# Altium project back breakout.PrjPcb
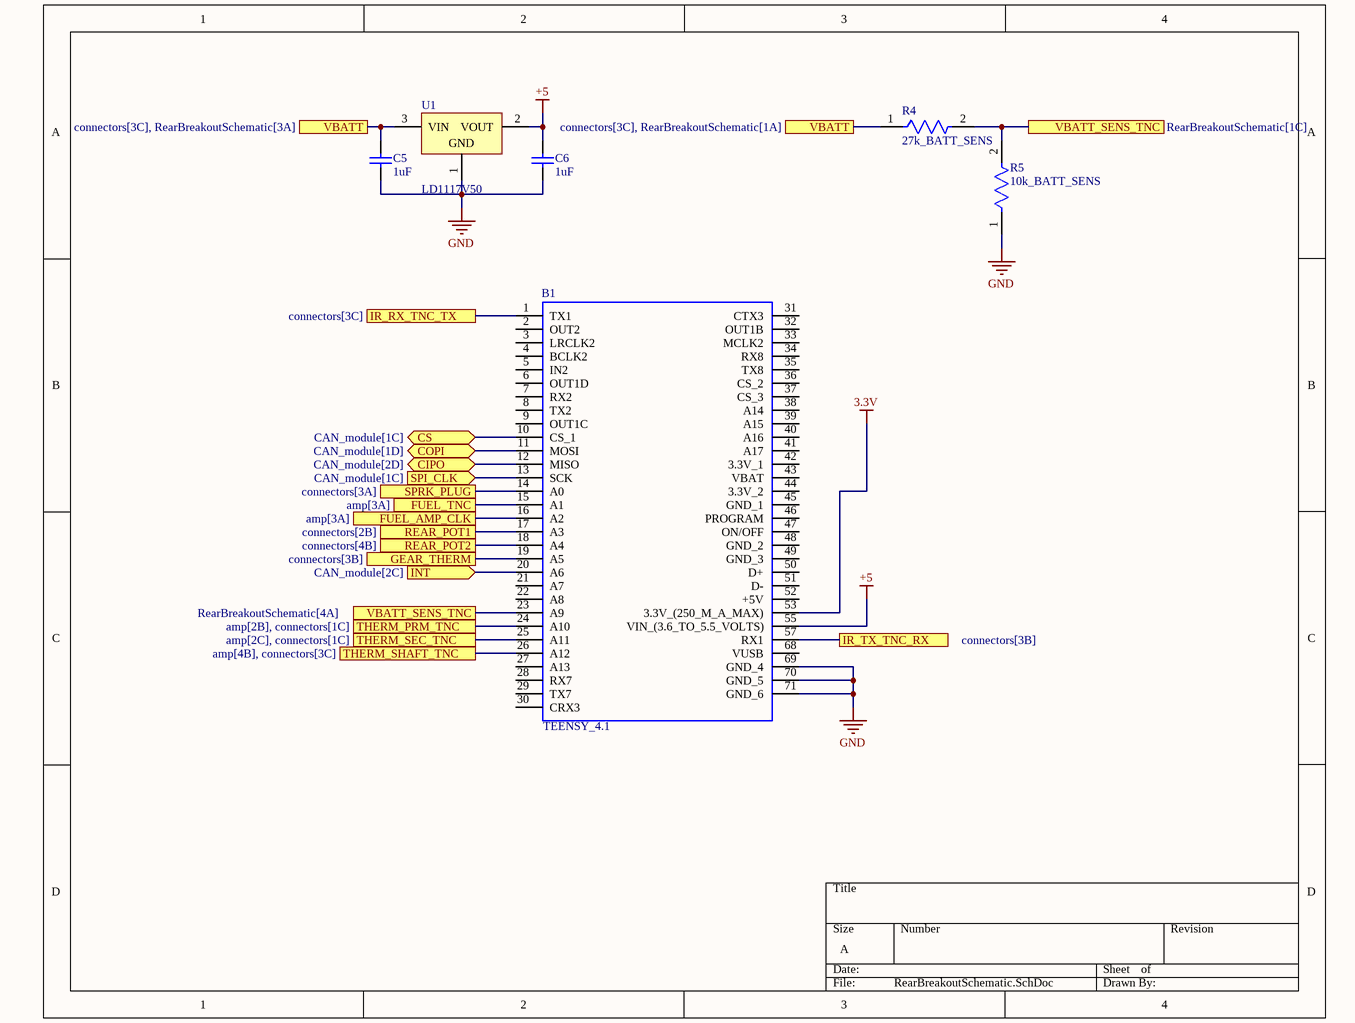
[diagram p0: RearBreakoutSchematic.SchDoc]
4 sheets, 34 parts. Net scope: flat (ports and power ports of the same name join across sheets).
Board file: backBreakoutPCB.PcbDoc
Sheets:
  RearBreakoutSchematic.SchDoc
  CAN_module.SchDoc
  connectors.SchDoc
  amp.SchDoc

## Sheet RearBreakoutSchematic.SchDoc
size A; SheetNumber: 1; SheetTotal: 4

### Parts
B1  TEENSY_4.1  [TEENSY41]
C5  1uF  [CAPC2013X145X50LL20T25]
C6  1uF  [CAPC2013X145X50LL20T25]
R4  27k_BATT_SENS  [FP-CRCW0805-e3-IPC_C]
R5  10k_BATT_SENS  [FP-CRCW0805-e3-IPC_C]
U1  LD1117V50  [TO220]

### Ports
CIPO (bidir, see CAN_module[2D]), COPI (bidir, see CAN_module[1D]), CS (bidir, see CAN_module[1C]), FUEL_AMP_CLK (see amp[3A]), FUEL_TNC (see amp[3A]), GEAR_THERM (see connectors[3B]), INT (in, see CAN_module[2C]), IR_RX_TNC_TX (see connectors[3C]), IR_TX_TNC_RX (see connectors[3B]), REAR_POT1 (see connectors[2B]), REAR_POT2 (see connectors[4B]), SPI_CLK (in, see CAN_module[1C]), SPRK_PLUG (see connectors[3A]), THERM_PRM_TNC (see amp[2B], connectors[1C]), THERM_SEC_TNC (see amp[2C], connectors[1C]), THERM_SHAFT_TNC (see amp[4B], connectors[3C]), VBATT (see connectors[3C], RearBreakoutSchematic[1A]), VBATT (see connectors[3C], RearBreakoutSchematic[3A]), VBATT_SENS_TNC (see RearBreakoutSchematic[1C]), VBATT_SENS_TNC (see RearBreakoutSchematic[4A])

### Nets
3.3V: B1.53(3.3V_(250_M_A_MAX))
+5: B1.55(VIN_(3.6_TO_5.5_VOLTS)) C6.2 U1.2(VOUT)
GND: B1.69(GND_4) B1.70(GND_5) B1.71(GND_6) C5.1 C6.1 R5.1 U1.1(GND)
REAR_POT1: B1.17(A3) ; port REAR_POT1
REAR_POT2: B1.18(A4) ; port REAR_POT2
NetB1_1: B1.1(TX1) ; port IR_RX_TNC_TX
NetB1_10: B1.10(CS_1) ; port CS
NetB1_11: B1.11(MOSI) ; port COPI
NetB1_12: B1.12(MISO) ; port CIPO
NetB1_13: B1.13(SCK) ; port SPI_CLK
NetB1_14: B1.14(A0) ; port SPRK_PLUG
NetB1_15: B1.15(A1) ; port FUEL_TNC
NetB1_16: B1.16(A2) ; port FUEL_AMP_CLK
NetB1_19: B1.19(A5) ; port GEAR_THERM
NetB1_20: B1.20(A6) ; port INT
NetB1_23: B1.23(A9) R4.2 R5.2 ; port VBATT_SENS_TNC
NetB1_24: B1.24(A10) ; port THERM_PRM_TNC
NetB1_25: B1.25(A11) ; port THERM_SEC_TNC
NetB1_26: B1.26(A12) ; port THERM_SHAFT_TNC
NetB1_57: B1.57(RX1) ; port IR_TX_TNC_RX
NetC5_2: C5.2 R4.1 U1.3(VIN) ; port VBATT

Not connected (* = marked no-connect by the designer): B1 2(OUT2) 3(LRCLK2) 4(BCLK2) 5(IN2) 6(OUT1D) 7(RX2) 8(TX2) 9(OUT1C) 21(A7) 22(A8) 27(A13) 28(RX7) 29(TX7) 30(CRX3) 31(CTX3) 32(OUT1B) 33(MCLK2) 34(RX8) 35(TX8) 36(CS_2) 37(CS_3) 38(A14) 39(A15) 40(A16) 41(A17) 42(3.3V_1) 43(VBAT) 44(3.3V_2) 45(GND_1) 46(PROGRAM) 47(ON/OFF) 48(GND_2) 49(GND_3) 50(D+) 51(D-) 52(+5V) 68(VUSB)

### Library data of the parts
B1 = TEENSY_4.1: Teensy 4.1 Development Board; Manufacturer_Name: PJRC; Manufacturer_Part_Number: TEENSY 4.1; Mouser Part Number: *; Mouser Price/Stock: *; Arrow Part Number: *; Arrow Price/Stock: *; Mouser Testing Part Number: *; Mouser Testing Price/Stock: *; Datasheet Link: https://www.pjrc.com/store/teensy41.html
C5 C6 = CMP-1036-04746-2: C0805C105K4PACTU; Manufacturer: Kemet; Part Number: C0805C105K4PACTU
R4 R5 = CMP-02407-009256-1: RES Thick Film, 4.02Ω, 1%, 0.125W, 200ppm/°C, 0805; Resistance: 4.02R; Power Rating: 125mW; Voltage Rating: 150V; Features: Automotive AEC-Q200; Weight: 0.000194oz; Height: 0.02inch; Case Code (Metric): 2012; Composition: Thick Film; Temperature Coefficient: 200ppm/°C; Case/Package: 0805; Min Operating Temperature: -55°C; Width: 0.049inch; Contact Plating: Tin; Packaging: Tape and Reel; Tolerance: 1%; Length: 0.079inch; Lead Free: Lead Free; Case Code (Imperial): 0805; Package Quantity: 5000; Radiation Hardening: No; Max Operating Temperature: 155°C; Number of Terminations: 2; Max Power Dissipation: 125mW; Voltage Rating (DC): 150V
U1 = CMP-0244-00472-1: Fixed Low Drop Positive Voltage Regulator, 5V, 3-Pin TO-220; ComponentLink1URL: http://www.st.com; ComponentLink1Description: Manufacturer URL; DatasheetVersion: 1/11/2011; PackageDescription: TO, Thru-Hole, Vertical, Heatsink Mounted; 3 In-Line Leads; Pitch 2.54 mm; ComponentLink2Description: Datasheet; ComponentLink3URL: http://www.st.com/internet/com/TECHNICAL_RESOURCES/TECHNICAL_LITERATURE/PACKAGE_INFORMATION/CD00004649.pdf; PackageVersion: ver3.0; PackageReference: TO220; ComponentLink2URL: http://www.st.com/internet/com/TECHNICAL_RESOURCES/TECHNICAL_LITERATURE/DATASHEET/CD00000544.pdf; ComponentLink3Description: Package Specification

## Sheet CAN_module.SchDoc
size A; SheetNumber: 2; SheetTotal: 4
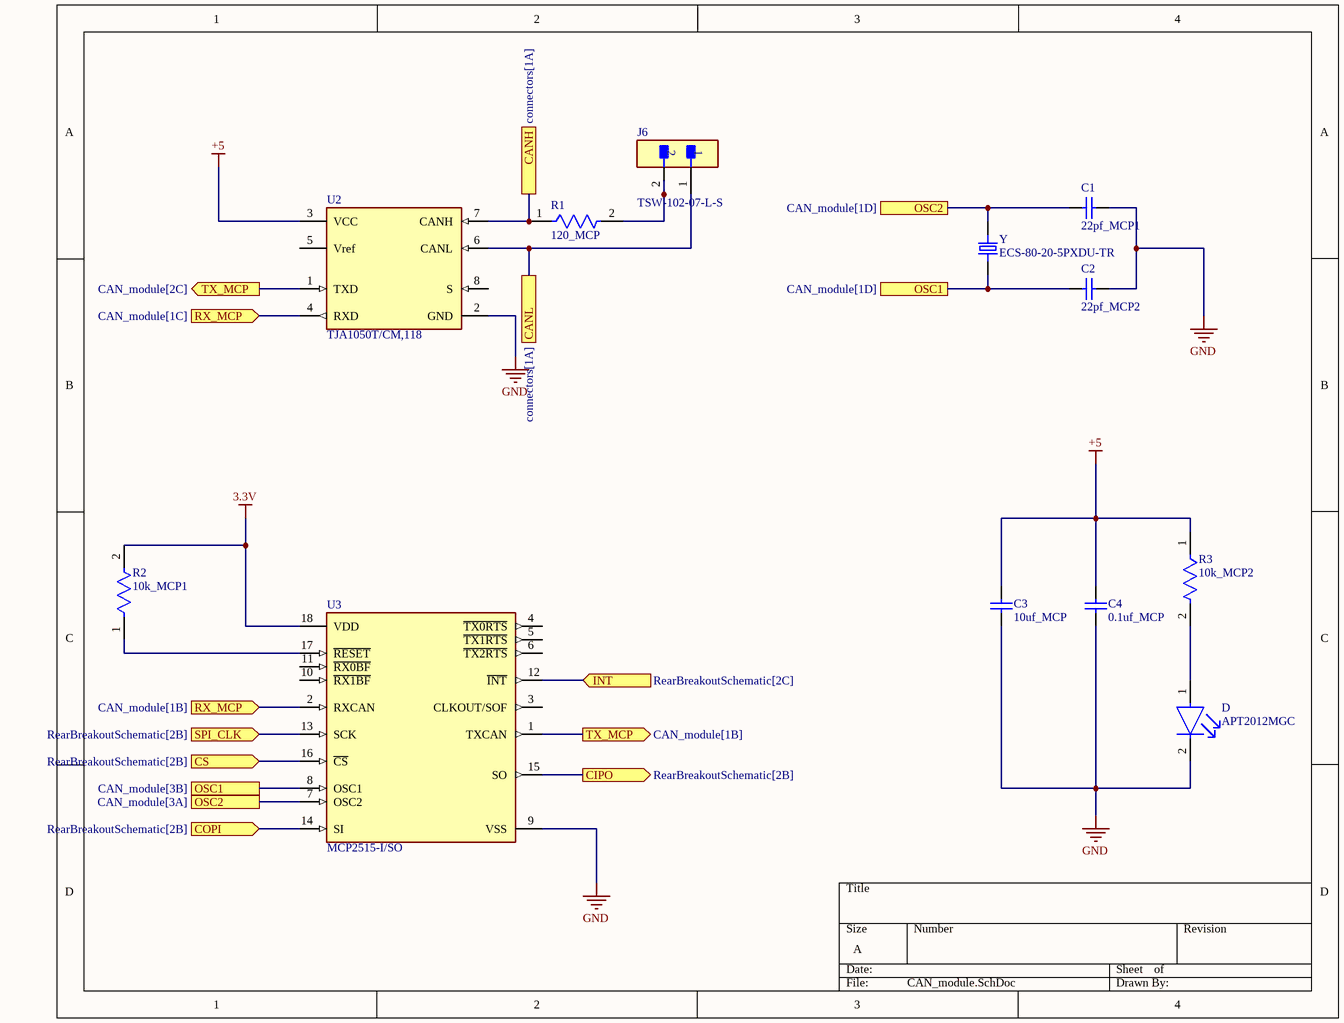
[diagram p1: CAN_module.SchDoc]

### Parts
C1  22pf_MCP1  [CAPC2013X145X50NL20T20]
C2  22pf_MCP2  [CAPC2013X145X50NL20T20]
C3  10uf_MCP  [CAPC2013X145X50NL20T20]
C4  0.1uf_MCP  [CAPC2013X145X50NL20T20]
D  APT2012MGC  [FP-APT2012MGC-MFG]
J6  TSW-102-07-L-S  [FP-TSW-102-07-L-S-MFG]
R1  120_MCP  [FP-CRCW0805-e3-IPC_C]
R2  10k_MCP1  [FP-CRCW0805-e3-IPC_C]
R3  10k_MCP2  [FP-CRCW0805-e3-IPC_C]
U2  TJA1050T/CM,118  [FP-SOT96-1-IPC_A]
U3  MCP2515-I/SO  [FP-C04-051-MFG]
Y  ECS-80-20-5PXDU-TR  [XTAL_ECS-80-20-5PXDU-TR]

### Ports
CANH (see connectors[1A]), CANL (see connectors[1A]), CIPO (out, see RearBreakoutSchematic[2B]), COPI (in, see RearBreakoutSchematic[2B]), CS (in, see RearBreakoutSchematic[2B]), INT (in, see RearBreakoutSchematic[2C]), OSC1 (see CAN_module[1D]), OSC1 (see CAN_module[3B]), OSC2 (see CAN_module[1D]), OSC2 (see CAN_module[3A]), RX_MCP (in, see CAN_module[1B]), RX_MCP (in, see CAN_module[1C]), SPI_CLK (in, see RearBreakoutSchematic[2B]), TX_MCP (out, see CAN_module[1B]), TX_MCP (out, see CAN_module[2C])

### Nets
3.3V: R2.2 U3.18(VDD)
+5: C3.2 C4.2 R3.1 U2.3(VCC)
GND: C1.2 C2.2 C3.1 C4.1 D.2(C) U2.2(GND) U3.9(VSS)
NetB1_10: U3.16(~{CS}) ; port CS
NetB1_11: U3.14(SI) ; port COPI
NetB1_12: U3.15(SO) ; port CIPO
NetB1_13: U3.13(SCK) ; port SPI_CLK
NetB1_20: U3.12(~{INT}) ; port INT
NetC1_1: C1.1 U3.7(OSC2) Y.2 ; port OSC2
NetC2_1: C2.1 U3.8(OSC1) Y.1 ; port OSC1
NetD_1: D.1(A) R3.2
NetJ1_3: J6.1 U2.6(CANL) ; port CANL
NetJ1_4: R1.1 U2.7(CANH) ; port CANH
NetJ6_2: J6.2 R1.2
NetR2_1: R2.1 U3.17(~{RESET})
NetU2_1: U2.1(TXD) U3.1(TXCAN) ; port TX_MCP
NetU2_4: U2.4(RXD) U3.2(RXCAN) ; port RX_MCP

Not connected (* = marked no-connect by the designer): U2 5(Vref) 8(S); U3 3(CLKOUT/SOF) 4(~{TX0RTS}) 5(~{TX1RTS}) 6(~{TX2RTS}) 10(~{RX1BF}) 11(~{RX0BF})

### Library data of the parts
C1-C4 = CMP-1036-01227-2: Manufacturer: Vitramon; Part Number: VJ0805A220GXXCW1BC
D = CMP-44529-000017-1: LED GREEN CLEAR CHIP SMD; Power Rating: 75mW; Lens Color: Colorless; Luminous Intensity: 70mcd; Forward Current: 20mA; Dominant Wavelength: 570nm; Viewing Angle: 120°; Forward Voltage: 2.1V; Package Quantity: 2000; Color: Green; Length: 2mm; Lead Free: Lead Free; Min Operating Temperature: -40°C; Illumination Color: Green; Case/Package: 0805; Width: 1.25mm; Test Current: 20mA; Max Operating Temperature: 85°C; Case Code (Imperial): 0805; Mount: Surface Mount; Lens Style: Clear; Height: 0.75mm; Case Code (Metric): 2012; Packaging: Tape and Reel; Lens Transparency: Clear
J6 = CMP-02766-001428-1: CONN HEADER VERT 2POS 2.54MM; Voltage Rating: 550V; Current Rating: 7.6A; Gender: Male; Number of Contacts: 2; Connector Type: Male Pin; Radiation Hardening: No; Orientation: Straight; Contact Plating: Gold; Max Operating Temperature: 125°C; Mount: Through Hole; Package Quantity: 1; Number of Rows: 1; Housing Material: Polyester; RoHS Compliant: Yes; Length: 5.08mm; Max Voltage Rating (AC): 550V; Pitch: 2.54mm; Packaging: Bulk; Depth: 2.54mm; Termination: Solder; Min Operating Temperature: -55°C; Housing Color: Black; Lead Free: Lead Free; Color: Black; Number of Positions: 2; Width: 2.54mm; Max Current Rating: 7.6A; REACH SVHC: No SVHC; Contact Material: Bronze; Contact Mating Length: 0.23inch; Series: TSW; Contact Type: Male Pin
R1-R3 = CMP-02407-009256-1: as R4 on sheet RearBreakoutSchematic; Features: Automotive AEC-Q200; Weight: 0.000194oz; Height: 0.02inch; Case Code (Metric): 2012; Composition: Thick Film; Temperature Coefficient: 200ppm/°C; Case/Package: 0805; Min Operating Temperature: -55°C; Width: 0.049inch; Contact Plating: Tin; Packaging: Tape and Reel; Tolerance: 1%; Length: 0.079inch; Lead Free: Lead Free; Case Code (Imperial): 0805; Package Quantity: 5000; Radiation Hardening: No; Max Operating Temperature: 155°C; Number of Terminations: 2; Max Power Dissipation: 125mW; Voltage Rating (DC): 150V
U2 = CMP-2000-04923-2: IC TRANSCEIVER HALF 1/1 8SO; Simplex/Duplex: Half Duplex; Max Supply Current: 10mA; Number of Receive Buffers: 1; Min Supply Voltage: 4.75V; Max Supply Voltage: 5.25V; Interface: CAN; Data Rate: 1Mbps; Receiver Hysteresis: 70mV; Number of Transmit Buffers: 1; Min Operating Temperature: -40°C; Case/Package: SO; REACH SVHC: No SVHC; Max Operating Temperature: 150°C; Number of Pins: 8; Lead Free: Lead Free; Number of Transceivers: 1; Packaging: Tape and Reel; Mount: Surface Mount; Radiation Hardening: No; Nominal Supply Current: 10mA; Package Quantity: 2500; Contact Plating: Gold
U3 = CMP-0186-00133-3: IC CAN CONTROLLER W/SPI 18SOIC; Manufacturer: Microchip; Min Supply Voltage: 2.7V; Max Supply Voltage: 5.5V; Standoff Height: 0.1mm; Nominal Supply Current: 10mA; Interface: SPI,CAN; Lead Free: Yes; Digikey Description: IC CAN CONTROLLER W/SPI 18SOIC; Category: IC; RoHS: TRUE; Manufacturer Part Number: MCP2515-I/SO; ComponentLink2URL: http://ww1.microchip.com/downloads/en/DeviceDoc/MCP2515-Stand-Alone-CAN-Controller-with-SPI-20001801J.pdf; Mouser Description: CAN Interface IC W/ SPI Interface; Device Class L2: Interface ICs; Package: C04-051; Automotive: No; Function: Controller; Octopart: https://octopart.com/mcp2515-i%2Fso-microchip-430187; Temperature: -40°C to +85°C; Ipc Land Pattern Name: SOIC127P1030X265-18; Ambient Temperature Range Low: -65°C; Height: 2.65mm; Device Class L1: Integrated Circuits (ICs); Ambient Temperature Range High: +125°C; Footprint Url: http://ww1.microchip.com/downloads/en/DeviceDoc/18L_SOIC_Wide_7.50_SO_C04-0051D.pdf; Temperature Range Low: -40°C; Device Class L3: Controllers; Temperature Range High: +85°C; ComponentLink2Description: Datasheet
Y = ECS-80-20-5PXDU-TR: 8MHz Â±30ppm Crystal 20pF 60 Ohms HC-49/US; MF: ECS Inc.; Package: HC49/US ECS International; Availability: Unavailable; Value: *; MP: ECS-80-20-5PXDU-TR; SnapEDA_Link: https://www.snapeda.com/parts/ECS-80-20-5PXDU-TR/ECS%20Inc./view-part/584052/?ref=snap; Price: None

## Sheet connectors.SchDoc
size A; SheetNumber: 3; SheetTotal: 4
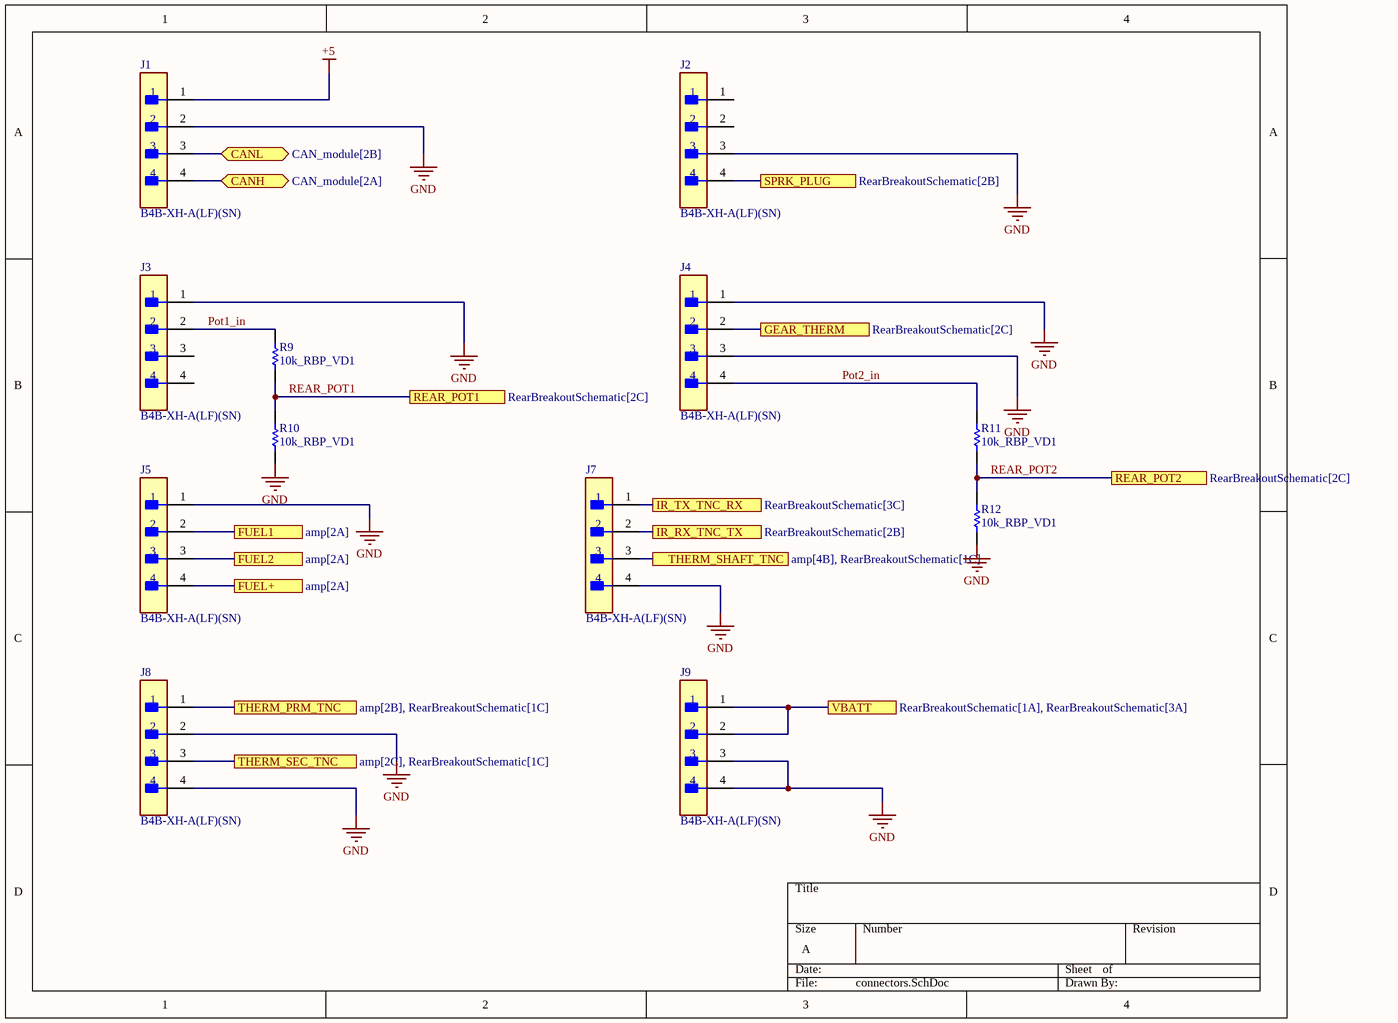
[diagram p2: connectors.SchDoc]

### Parts
J1  B4B-XH-A(LF)(SN)  [FP-B4B-XH-A_LF_SN-MFG]
J2  B4B-XH-A(LF)(SN)  [FP-B4B-XH-A_LF_SN-MFG]
J3  B4B-XH-A(LF)(SN)  [FP-B4B-XH-A_LF_SN-MFG]
J4  B4B-XH-A(LF)(SN)  [FP-B4B-XH-A_LF_SN-MFG]
J5  B4B-XH-A(LF)(SN)  [FP-B4B-XH-A_LF_SN-MFG]
J7  B4B-XH-A(LF)(SN)  [FP-B4B-XH-A_LF_SN-MFG]
J8  B4B-XH-A(LF)(SN)  [FP-B4B-XH-A_LF_SN-MFG]
J9  B4B-XH-A(LF)(SN)  [FP-B4B-XH-A_LF_SN-MFG]
R9  10k_RBP_VD1  [RESC2013X60X40LL20T25]
R10  10k_RBP_VD1  [RESC2013X60X40LL20T25]
R11  10k_RBP_VD1  [RESC2013X60X40LL20T25]
R12  10k_RBP_VD1  [RESC2013X60X40LL20T25]

### Ports
CANH (bidir, see CAN_module[2A]), CANL (bidir, see CAN_module[2B]), FUEL1 (see amp[2A]), FUEL2 (see amp[2A]), FUEL+ (see amp[2A]), GEAR_THERM (see RearBreakoutSchematic[2C]), IR_RX_TNC_TX (see RearBreakoutSchematic[2B]), IR_TX_TNC_RX (see RearBreakoutSchematic[3C]), REAR_POT1 (see RearBreakoutSchematic[2C]), REAR_POT2 (see RearBreakoutSchematic[2C]), SPRK_PLUG (see RearBreakoutSchematic[2B]), THERM_PRM_TNC (see amp[2B], RearBreakoutSchematic[1C]), THERM_SEC_TNC (see amp[2C], RearBreakoutSchematic[1C]), THERM_SHAFT_TNC (see amp[4B], RearBreakoutSchematic[1C]), VBATT (see RearBreakoutSchematic[1A], RearBreakoutSchematic[3A])

### Nets
+5: J1.1
GND: J1.2 J2.3 J3.1 J4.1 J4.3 J5.1 J7.4 J8.2 J8.4 J9.3 J9.4 R10.1 R12.1
Pot1_in: J3.2 R9.2
Pot2_in: J4.4 R11.2
REAR_POT1: R9.1 R10.2 ; port REAR_POT1
REAR_POT2: R11.1 R12.2 ; port REAR_POT2
NetB1_1: J7.2 ; port IR_RX_TNC_TX
NetB1_14: J2.4 ; port SPRK_PLUG
NetB1_19: J4.2 ; port GEAR_THERM
NetB1_24: J8.1 ; port THERM_PRM_TNC
NetB1_25: J8.3 ; port THERM_SEC_TNC
NetB1_26: J7.3 ; port THERM_SHAFT_TNC
NetB1_57: J7.1 ; port IR_TX_TNC_RX
NetC5_2: J9.1 J9.2 ; port VBATT
NetJ1_3: J1.3 ; port CANL
NetJ1_4: J1.4 ; port CANH
NetJ5_2: J5.2 ; port FUEL1
NetJ5_3: J5.3 ; port FUEL2
NetJ5_4: J5.4 ; port FUEL+

Not connected (* = marked no-connect by the designer): J2 1 2; J3 3 4

### Library data of the parts
J1-J5 J7-J9 = CMP-17439-000250-1: CONN HEADER VERT 4POS 2.5MM; Number of Contacts: 4; Contact Resistance: 20mR; Voltage Rating: 250V; Max Current Rating: 3A; Gender: Male; Wire/Cable Gauge: 22AWG; Mated Stacking Heights: 9.8mm; Insulation Resistance: 1GR; Orientation: Straight; Contact Type: Male Pin; Contact Finish - Mating: TIN; Series: XH; Max Voltage Rating (AC): 250V; Lead Pitch: 2.5mm; Contact Shape: Square; Insulation Color: Natural; Termination: Solder; Lead Free: Lead Free; Voltage Rating (AC): 250V; Number of Rows: 1; Flammability Rating: UL94 V-0; Number of Positions: 4; Max Operating Temperature: 85°C; Package Quantity: 500; Mount: Through Hole; REACH SVHC: No SVHC; Connector Type: Header; Insulation Material: Nylon; Fastening Type: Detent; Min Operating Temperature: -25°C; Housing Color: White; Packaging: Bulk; Contact Plating: Tin; Contact Material: Brass; Max Voltage Rating (DC): 250V; Housing Material: Polyamide; Color: Natural; Material: Polyamide; Pitch: 2.5mm; Depth: 5.75mm; Current Rating: 3A; Length: 12.4mm
R9-R12 = CMP-2001-00877-1: Manufacturer: Panasonic; Part Number: ERA6AEB7870V

## Sheet amp.SchDoc
size A; SheetNumber: 4; SheetTotal: 4
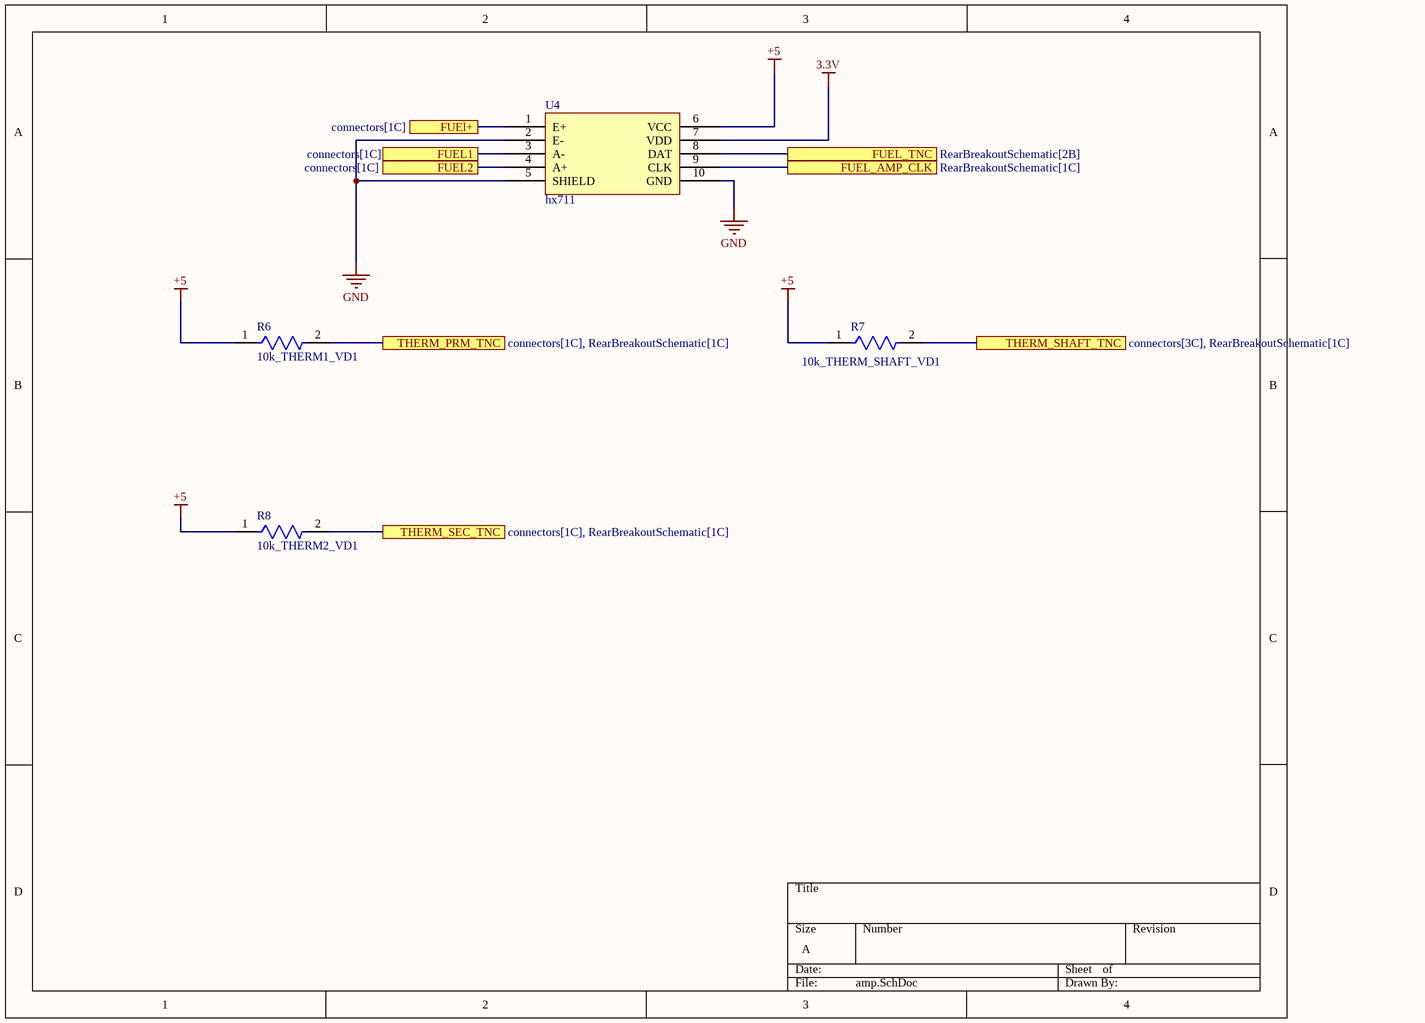
[diagram p3: amp.SchDoc]

### Parts
R6  10k_THERM1_VD1  [FP-CRCW0805-e3-IPC_C]
R7  10k_THERM_SHAFT_VD1  [FP-CRCW0805-e3-IPC_C]
R8  10k_THERM2_VD1  [FP-CRCW0805-e3-IPC_C]
U4  hx711  [PCBComponent_1]

### Ports
FUEL1 (see connectors[1C]), FUEL2 (see connectors[1C]), FUEl+ (see connectors[1C]), FUEL_AMP_CLK (see RearBreakoutSchematic[1C]), FUEL_TNC (see RearBreakoutSchematic[2B]), THERM_PRM_TNC (see connectors[1C], RearBreakoutSchematic[1C]), THERM_SEC_TNC (see connectors[1C], RearBreakoutSchematic[1C]), THERM_SHAFT_TNC (see connectors[3C], RearBreakoutSchematic[1C])

### Nets
3.3V: U4.7(VDD)
+5: R6.1 R7.1 R8.1 U4.6(VCC)
GND: U4.2(E-) U4.5(SHIELD) U4.10(GND)
NetB1_15: U4.8(DAT) ; port FUEL_TNC
NetB1_16: U4.9(CLK) ; port FUEL_AMP_CLK
NetB1_24: R6.2 ; port THERM_PRM_TNC
NetB1_25: R8.2 ; port THERM_SEC_TNC
NetB1_26: R7.2 ; port THERM_SHAFT_TNC
NetJ5_2: U4.3(A-) ; port FUEL1
NetJ5_3: U4.4(A+) ; port FUEL2
NetJ5_4: U4.1(E+) ; port FUEl+

### Library data of the parts
R6-R8 = CMP-02407-009256-1: as R4 on sheet RearBreakoutSchematic; Features: Automotive AEC-Q200; Weight: 0.000194oz; Height: 0.02inch; Case Code (Metric): 2012; Composition: Thick Film; Temperature Coefficient: 200ppm/°C; Case/Package: 0805; Min Operating Temperature: -55°C; Width: 0.049inch; Contact Plating: Tin; Packaging: Tape and Reel; Tolerance: 1%; Length: 0.079inch; Lead Free: Lead Free; Case Code (Imperial): 0805; Package Quantity: 5000; Radiation Hardening: No; Max Operating Temperature: 155°C; Number of Terminations: 2; Max Power Dissipation: 125mW; Voltage Rating (DC): 150V
U4 = Component_1

## Nets that join several sheets
3.3V: RearBreakoutSchematic (B1.53), CAN_module (R2.2 U3.18), amp (U4.7)
+5: RearBreakoutSchematic (B1.55 C6.2 U1.2), CAN_module (C3.2 C4.2 R3.1 U2.3), connectors (J1.1), amp (R6.1 R7.1 R8.1 U4.6)
GND: RearBreakoutSchematic (7 pins), CAN_module (7 pins), connectors (13 pins), amp (U4.2 U4.5 U4.10)
NetB1_1: RearBreakoutSchematic (B1.1), connectors (J7.2)
NetB1_10: RearBreakoutSchematic (B1.10), CAN_module (U3.16)
NetB1_11: RearBreakoutSchematic (B1.11), CAN_module (U3.14)
NetB1_12: RearBreakoutSchematic (B1.12), CAN_module (U3.15)
NetB1_13: RearBreakoutSchematic (B1.13), CAN_module (U3.13)
NetB1_14: RearBreakoutSchematic (B1.14), connectors (J2.4)
NetB1_15: RearBreakoutSchematic (B1.15), amp (U4.8)
NetB1_16: RearBreakoutSchematic (B1.16), amp (U4.9)
NetB1_19: RearBreakoutSchematic (B1.19), connectors (J4.2)
NetB1_20: RearBreakoutSchematic (B1.20), CAN_module (U3.12)
NetB1_24: RearBreakoutSchematic (B1.24), connectors (J8.1), amp (R6.2)
NetB1_25: RearBreakoutSchematic (B1.25), connectors (J8.3), amp (R8.2)
NetB1_26: RearBreakoutSchematic (B1.26), connectors (J7.3), amp (R7.2)
NetB1_57: RearBreakoutSchematic (B1.57), connectors (J7.1)
NetC5_2: RearBreakoutSchematic (C5.2 R4.1 U1.3), connectors (J9.1 J9.2)
NetJ1_3: CAN_module (J6.1 U2.6), connectors (J1.3)
NetJ1_4: CAN_module (R1.1 U2.7), connectors (J1.4)
NetJ5_2: connectors (J5.2), amp (U4.3)
NetJ5_3: connectors (J5.3), amp (U4.4)
NetJ5_4: connectors (J5.4), amp (U4.1)
REAR_POT1: RearBreakoutSchematic (B1.17), connectors (R9.1 R10.2)
REAR_POT2: RearBreakoutSchematic (B1.18), connectors (R11.1 R12.2)